# EasyEDA Pro project MRV_PCB_github_export.epro

# Schematic Adafruit TB6612
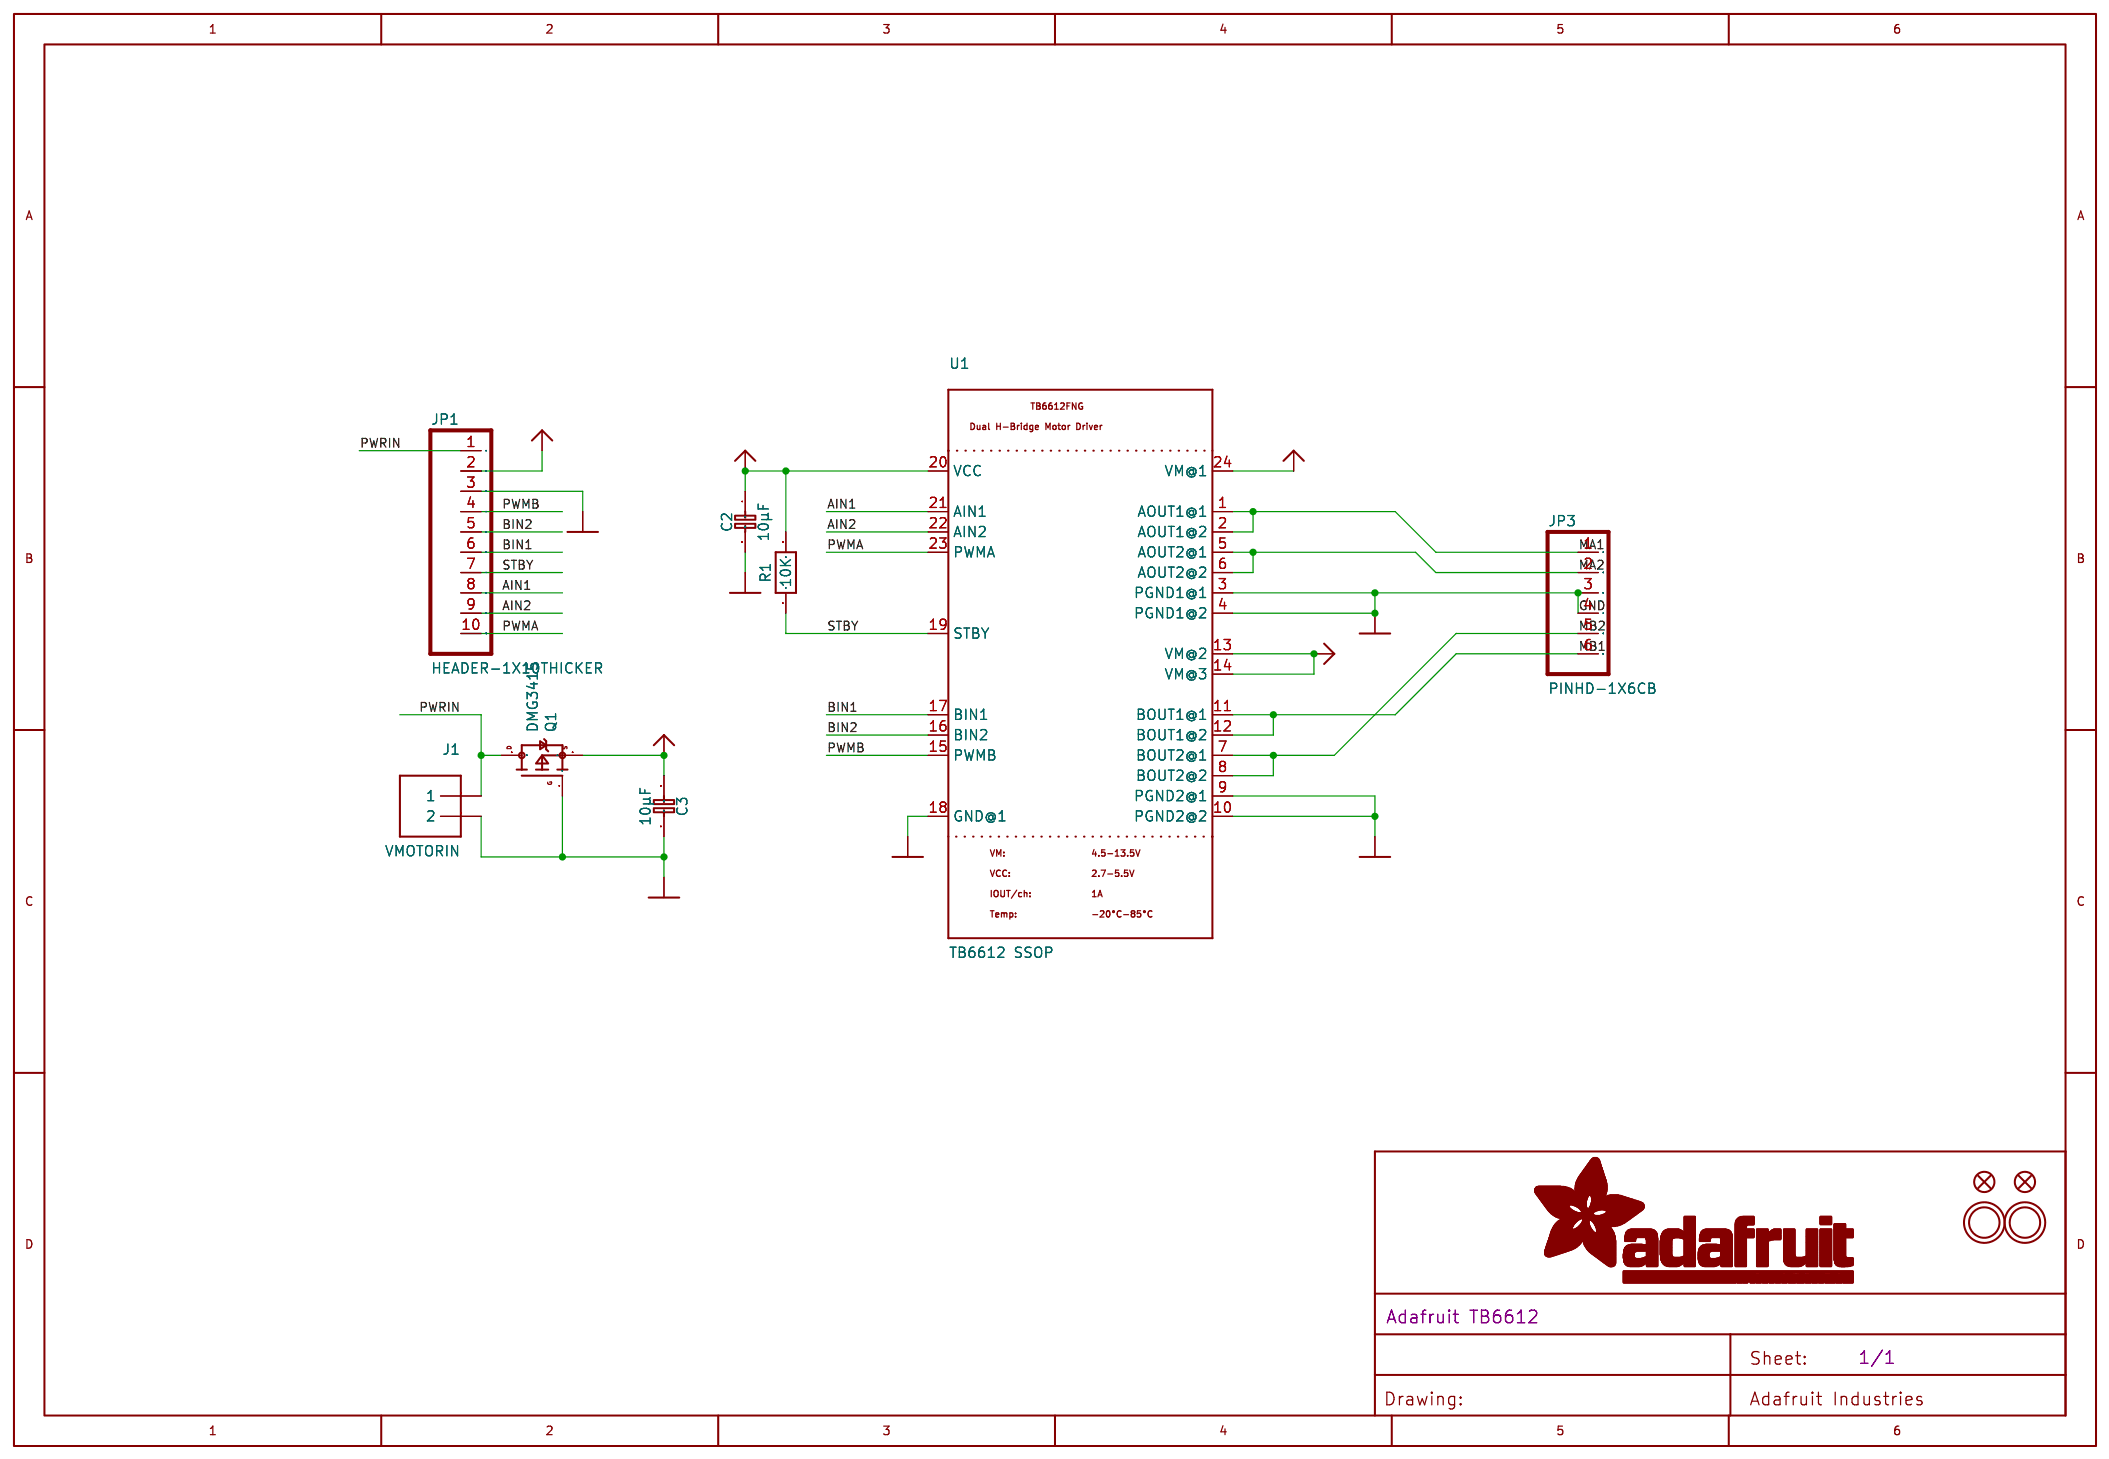
[diagram p0: schematic sheet]

## Parts
C2  10µF  [0805-NO]
C3  10µF  [0805-NO]
FID1  FIDUCIAL""  [FIDUCIAL_1MM]
FID2  FIDUCIAL""  [FIDUCIAL_1MM]
J1  VMOTORIN  [TERMBLOCK_1X2-3.5MM]
JP1  HEADER-1X10THICKER  [1X10_ROUND_76]
JP3  PINHD-1X6CB  [1X06-CLEANBIG]
Q1  DMG3415  [SOT23-WIDE]
R1  10K  [0805-NO]
U1  TB6612 SSOP  [SSOP24]
U$1  FRAME_A4_ADAFRUIT
U$13  MOUNTINGHOLE2.5  [MOUNTINGHOLE_2.5_PLATED]
U$14  MOUNTINGHOLE2.5  [MOUNTINGHOLE_2.5_PLATED]

## Library data of the parts
C2 C3 = microbuilder_CAP_CERAMIC_0805-NOOUTLINE
FID1 FID2 = microbuilder_FIDUCIAL_"": BOM: EXCLUDE
J1 = microbuilder_TERMBLOCK_1X2_
JP1 = microbuilder_HEADER-1X10_THICKER
JP3 = adafruit_PINHD-1X6_CB
Q1 = microbuilder_MOSFET-P_WIDE
R1 = microbuilder_RESISTOR_0805_NOOUTLINE
U1 = microbuilder_TB6612FNG_SSOP
U$1 = microbuilder_FRAME_A4_ADAFRUIT_: DRAWING_NAME: Adafruit TB6612; SHEET: 1/1
U$13 U$14 = microbuilder_MOUNTINGHOLE_2.5: BOM: EXCLUDE

## Nets
GND: C2.2 C3.2 J1.2 JP1.3 JP3.3 JP3.4 Q1.1(G) U1.3(PGND1@1) U1.4(PGND1@2) U1.9(PGND2@1) U1.10(PGND2@2) U1.18(GND@1)
VCC: C2.1 JP1.2 R1.2 U1.20(VCC)
AIN1: JP1.8 U1.21(AIN1)
AIN2: JP1.9 U1.22(AIN2)
BIN1: JP1.6 U1.17(BIN1)
BIN2: JP1.5 U1.16(BIN2)
MA1: JP3.1 U1.1(AOUT1@1) U1.2(AOUT1@2)
MA2: JP3.2 U1.5(AOUT2@1) U1.6(AOUT2@2)
MB1: JP3.6 U1.11(BOUT1@1) U1.12(BOUT1@2)
MB2: JP3.5 U1.7(BOUT2@1) U1.8(BOUT2@2)
PWMA: JP1.10 U1.23(PWMA)
PWMB: JP1.4 U1.15(PWMB)
PWRIN: J1.1 JP1.1 Q1.3(D)
STBY: JP1.7 R1.1 U1.19(STBY)
VMOTOR: C3.1 Q1.2(S) U1.13(VM@2) U1.14(VM@3) U1.24(VM@1)

# Schematic Battery
Create Date: 2026-02-02; Page Name: P1; Project Name: MRV; Schematic Name: Battery; Update Date: 2026-02-02; Company: EasyEDA.com; Page Size: A4; Version: V1.0
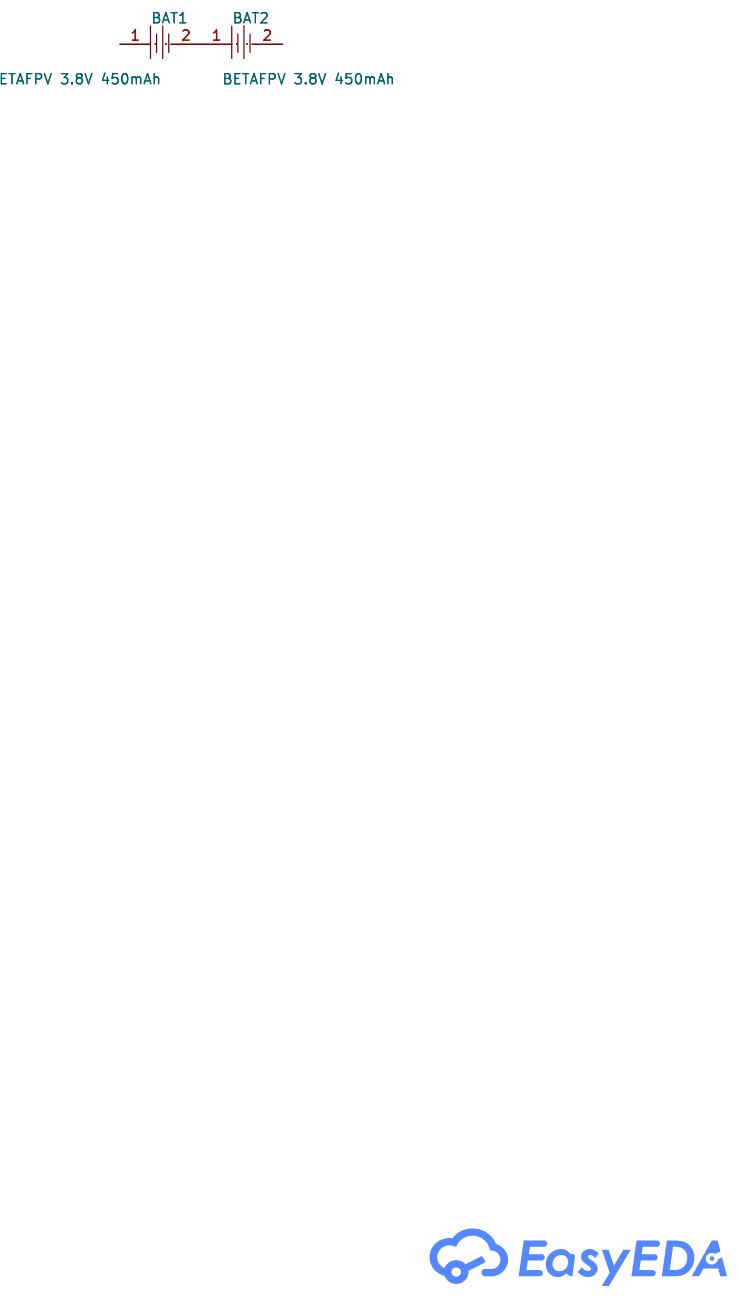
[diagram p1: schematic sheet]

## Parts
BAT1  BETAFPV 3.8V 450mAh  [BAT-TH_BD14.1-P5.30-D0.8_H49.55]
BAT2  BETAFPV 3.8V 450mAh  [BAT-TH_BD14.1-P5.30-D0.8_H49.55]

## Library data of the parts
BAT1 BAT2 = SVM1450 3.7V 500mAh: nominal voltage:3.7V capacity:560mAh Chemical system:Lithium Manganate size:14.07mm×49.55mm model No:- Type:Battery Type of electrolyte:- unit:1 Piece Battery Rechargeability:Rechargeable; LCSC Part Name: Sharvin Power(经钛电子) 锰酸锂电池 3.7V 560mAh 1个; Supplier Part: C42404727; Manufacturer: Sharvin Power(经钛电子); Datasheet: https://item.szlcsc.com/datasheet/SVM1450%25203.7V%2520500mAh/44369696.html; Supplier: LCSC; nominal voltage: 3.7V; capacity: 560mAh; Chemical system: Lithium Manganate; size: 14.07mm×49.55mm; Type: Battery; unit: 1 Piece; Battery Rechargeability: Rechargeable

## Nets
Net-(BAT1-2): BAT1.2 BAT2.1

Not connected (* = marked no-connect by the designer): BAT1 1; BAT2 2

# Schematic SCH_Servo-Motor-SG-90_2026-02-02
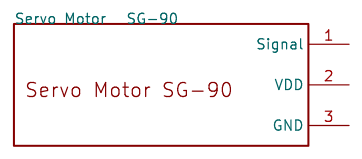
[diagram p2: schematic sheet]

## Parts
SG-90  Servo Motor

## Library data of the parts
SG-90 = Servo Motor

## Nets

Not connected (* = marked no-connect by the designer): SG-90 1(Signal) 2(VDD) 3(GND)

# Schematic Schematic1
Board Name: Board1; Create Date: 2026-02-04; Page Name: P1; Project Name: MRV; Schematic Name: Schematic1; Update Date: 2026-02-05; Company: EasyEDA.com; Page Size: A4; Version: V1.0
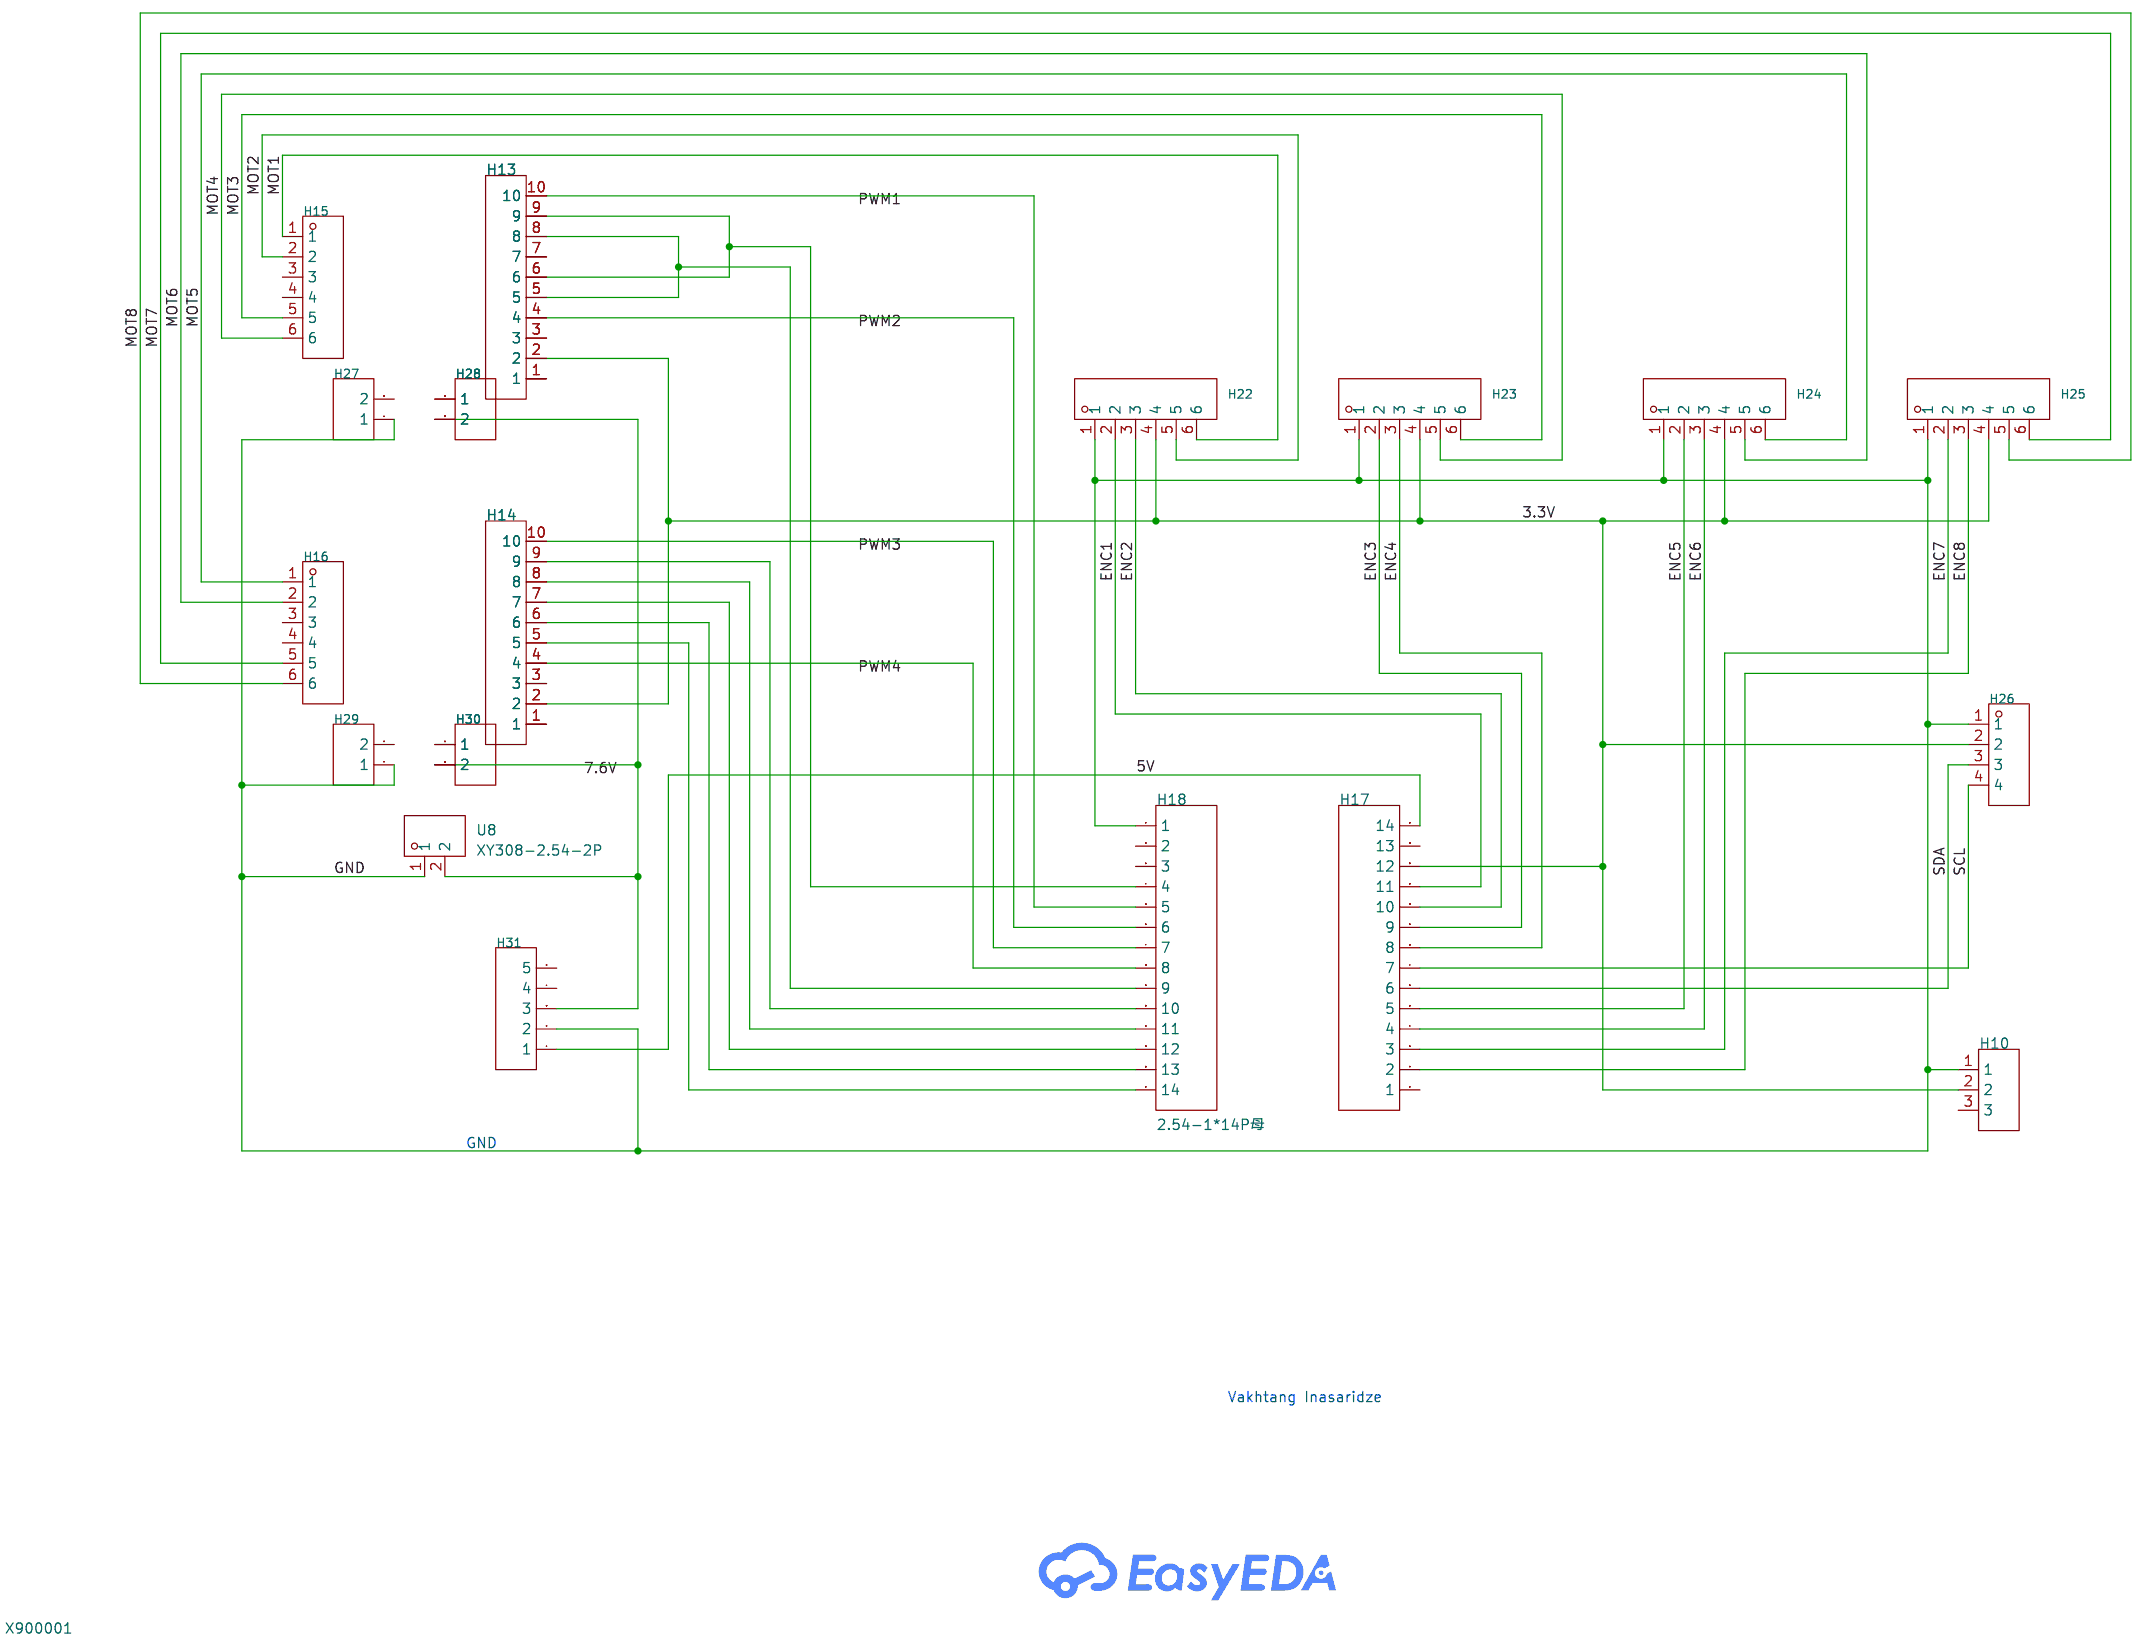
[diagram p3: schematic sheet]

## Parts
H10  -  [HDR-TH_3P-P2.54-V-M]
H13  -  [HDR-TH_10P-P2.54-V-F]
H14  -  [HDR-TH_10P-P2.54-V-F]
H15  -  [HDR-TH_6P-P2.54-V-F]
H16  -  [HDR-TH_6P-P2.54-V-F]
H17  2.54-1*14P母  [HDR-TH_14P-P2.54-V-F-1]
H18  2.54-1*14P母  [HDR-TH_14P-P2.54-V-F-1]
H22  -  [HDR-TH_6P-P2.54-V-F]
H23  -  [HDR-TH_6P-P2.54-V-F]
H24  -  [HDR-TH_6P-P2.54-V-F]
H25  -  [HDR-TH_6P-P2.54-V-F]
H26  -  [HDR-TH_4P-P2.54-V-F]
H27  -  [HDR-TH_2P-P2.54-V-F]
H28  -  [HDR-TH_2P-P2.54-V-F]
H29  -  [HDR-TH_2P-P2.54-V-F]
H30  -  [HDR-TH_2P-P2.54-V-F]
H31  -  [HDR-TH_5P-P2.54-V-F]
U8  XY308-2.54-2P  [CONN-TH_XY308-2.54-2P]

## Library data of the parts
H10 = HDR-M_2.54_1x3P: Supplier Footprint: Through
H13 H14 = HDR-F_2.54_1x10P: Supplier Footprint: Through
H15 H16 H22-H25 = HDR-F_2.54_1x6P: Supplier Footprint: Through
H17 H18 = 2.54-1*14P母: Holes Structure:1x14P Pitch:2.54mm Row Spacing:- Circular Hole / Square Hole:Square Hole Mounting Type:Through Hole Number of Rows:1 Number of Positions:14P Current Rating:3A Voltage Rating (Max):- Holes Direction:Top Insulation Height:- Contact Material:; LCSC Part Name: 1x14P 间距:2.54mm 直插; Supplier Part: C52711; Manufacturer: BOOMELE(博穆精密); Supplier Footprint: 插件,P=2.54mm; JLCPCB Part Class: Extended Part; Datasheet: https://item.szlcsc.com/datasheet/2.54-1*14P%25E6%25AF%258D/53725.html; Supplier: LCSC; Holes Structure: 1x14P; Pitch: 2.54mm; Circular Hole / Square Hole: Square Hole; Mounting Type: Through Hole; Number of Rows: 1; Number of Positions: 14P; Current Rating: 3A; Holes Direction: Top; Contact Material: Brass; Operating Temperature: -40℃~+105℃; PIN Length: 3.3mm
H26 = HDR-F_2.54_1x4P: Supplier Footprint: Through
H27-H30 = HDR-F_2.54_1x2P: Supplier Footprint: Through
H31 = HDR-F_2.54_1x5P: Supplier Footprint: Through
U8 = XY308-2.54-2P: Number of Positions or Pins:1x2P Pitch:2.54mm Color:Green Mounting Type:Through Hole Number of Pins:2P Number of Rows:1 Number of PINs Per Row:2 Screw Specification:M1.6 Current Rating:6A Voltage Rating (Max):150V Wire Gauge - AWG:18~26 Wire Gauge - mm2:1; LCSC Part Name: 1x2P 2.54mm 直插 排数:1 每排P数:2; Supplier Part: C557685; Manufacturer: XINLAIYA(新莱亚); Supplier Footprint: 插件,P=2.54mm; JLCPCB Part Class: Extended Part; Datasheet: https://item.szlcsc.com/datasheet/XY308-2.54-2P/581048.html; Supplier: LCSC; Number of Positions or Pins: 1x2P; Pitch: 2.54mm; Color: Green; Mounting Type: Through Hole; Number of Pins: 2P; Number of Rows: 1; Number of PINs Per Row: 2; Screw Specification: M1.6; Current Rating: 6A; Voltage Rating (Max): 150V; Wire Gauge - AWG: 18~26; Wire Gauge - mm2: 1

## Nets
3.3V: H10.2 H13.2 H14.2 H17.12 H22.4 H23.4 H24.4 H25.4 H26.2
5V: H17.14 H31.1
7.6V: H28.2 H30.2 H31.3 U8.2
GND: H10.1 H18.1 H22.1 H23.1 H24.1 H25.1 H26.1 H27.1 H29.1 H31.2 U8.1
ENC1: H17.11 H22.2
ENC2: H17.10 H22.3
ENC3: H17.9 H23.2
ENC4: H17.8 H23.3
ENC5: H17.5 H24.2
ENC6: H17.4 H24.3
ENC7: H17.3 H25.2
ENC8: H17.2 H25.3
MOT1: H15.1 H22.6
MOT2: H15.2 H22.5
MOT3: H15.5 H23.6
MOT4: H15.6 H23.5
MOT5: H16.1 H24.6
MOT6: H16.2 H24.5
MOT7: H16.5 H25.6
MOT8: H16.6 H25.5
PWM1: H13.10 H18.5
PWM2: H13.4 H18.6
PWM3: H14.10 H18.7
PWM4: H14.4 H18.8
SCL: H17.7 H26.4
SDA: H17.6 H26.3
$1N1454: H13.6 H13.9 H18.4
$1N1462: H13.5 H13.8 H18.9
Net-(H14-5): H14.5 H18.14
Net-(H14-6): H14.6 H18.13
Net-(H14-7): H14.7 H18.12
Net-(H14-8): H14.8 H18.11
Net-(H14-9): H14.9 H18.10

Not connected (* = marked no-connect by the designer): H10 3; H13 1 3 7; H14 1 3; H15 3 4; H16 3 4; H17 1 13; H18 2 3; H27 2; H28 1; H29 2; H30 1; H31 4 5

## Notes on the sheet
- GND
- Vakhtang Inasaridze

# Schematic SparkFun_Micro_6DoF_LSM6DSV16X
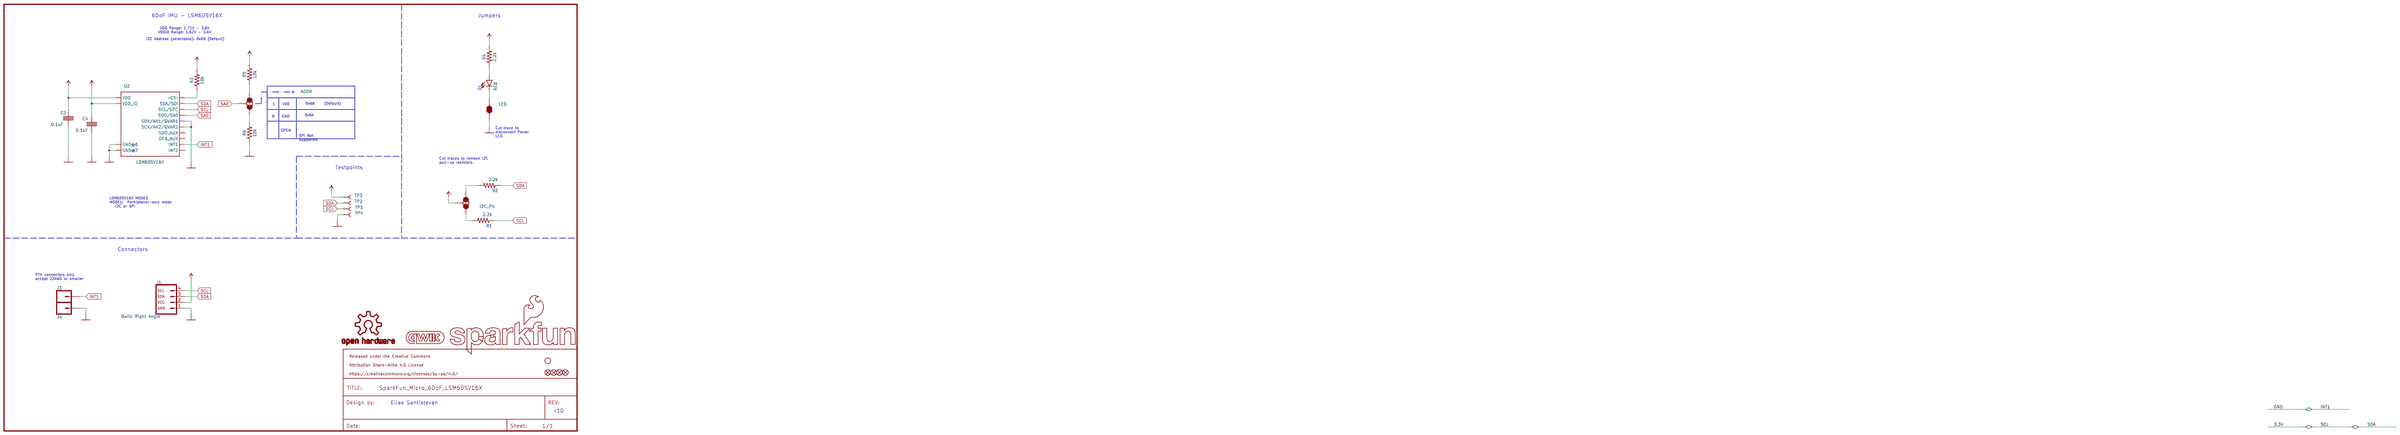
[diagram p4: schematic sheet]

## Parts
ADDR  JUMPER-SMT_3_1-NC_TRACE_SILK  [SMT-JUMPER_3_1-NC_TRACE_SILK]
C3  0.1uF  [0402-TIGHT]
C4  0.1uF  [0402-TIGHT]
D1  RED  [LED-0402]
FD1  FIDUCIALUFIDUCIAL  [FIDUCIAL-MICRO]
FD2  FIDUCIALUFIDUCIAL  [FIDUCIAL-MICRO]
FID1  FIDUCIALUFIDUCIAL  [FIDUCIAL-MICRO]
FID2  FIDUCIALUFIDUCIAL  [FIDUCIAL-MICRO]
FRAME1  FRAME-LETTER  [CREATIVE_COMMONS]  (sections G$1,V)
I2C_PU  S_MODE  [SMT-JUMPER_3_2-NC_TRACE_SILK]
J1  Qwiic Right Angle  [JST04_1MM_RA]
J3  CONN_01_1MM  [1X01_1MM_NO_SILK]
J4  CONN_01_1MM  [1X01_1MM_NO_SILK]
LED  JUMPER-SMT_2_NC_TRACE_SILK  [SMT-JUMPER_2_NC_TRACE_SILK]
LOGO1  QWIIC_LOGO_3MM  [QWIIC_3MM]
LOGO2  OSHW-LOGOMINI  [OSHW-LOGO-MINI]
LOGO3  SFE_LOGO_NAME_FLAMEBLANK  [BLANK]
R1  2.2k  [0402-TIGHT]
R2  2.2k  [0402-TIGHT]
R3  10k  [0402-TIGHT]
R4  2.2k  [0402-TIGHT]
R5  10k  [0402-TIGHT]
R6  10k  [0402-TIGHT]
STANDOFF1  STAND-OFFTIGHT  [STAND-OFF-TIGHT]
TP1  TEST-POINT3  [PAD.03X.03]
TP2  TEST-POINT3  [PAD.03X.03]
TP3  TEST-POINT3  [PAD.03X.03]
TP4  TEST-POINT3  [PAD.03X.03]
U2  LSM6DSV16X  [LGA-14L]

## Library data of the parts
ADDR = SparkFun-Jumpers_JUMPER-SMT_3_1-NC_TRACE__SILK
C3 C4 = SparkFun-Capacitors_0.1UF_-0402T-6.3V-10%-X7R
D1 = SparkFun-LED_LED-RED__0402: PROD_ID: DIO-16757
FD1 FD2 FID1 FID2 = SparkFun-Aesthetics_FIDUCIAL_UFIDUCIAL
FRAME1 = SparkFun-Aesthetics_FRAME-LETTER_: DESIGNER: Elias Santistevan; SHEET: 1/1; DRAWING_NAME: SparkFun_Micro_6DoF_LSM6DSV16X
I2C_PU = SparkFun-Jumpers_JUMPER-SMT_3_2-NC_TRACE__SILK
J1 = SparkFun-Connectors_I2C_STANDARD_QWIIC: PROD_ID: CONN-13694
J3 J4 = SparkFun-Connectors_CONN_01__1MM
LED = SparkFun-Jumpers_JUMPER-SMT_2_NC_TRACE__SILK
LOGO1 = SparkFun-Aesthetics_QWIIC_LOGO__3MM
LOGO2 = SparkFun-Aesthetics_OSHW-LOGO_MINI
LOGO3 = SparkFun-Aesthetics_SFE_LOGO_NAME_FLAME_BLANK
R1 R2 R4 = SparkFun-Resistors_2.2KOHM_-0402T-1/16W-1%
R3 R5 R6 = SparkFun-Resistors_10KOHM_-0402T-1/16W-1%: PROD_ID: CAP-14993
STANDOFF1 = SparkFun-Hardware_STAND-OFF_TIGHT
TP1-TP4 = SparkFun-Connectors_TEST-POINT_3
U2 = lsm6dsv16x_LSM6DSV16X_: PROD_ID: IC-17274

## Nets
3.3V: C3.1 C4.1 I2C_PU.2 J1.2 J1.3 J1.4 R1.1 R2.1 R3.2 R4.2 R5.2 TP1.1 TP2.1 TP3.1 U2.P5(VDD_IO) U2.P8(VDD) U2.P13(SCL/SPC) U2.P14(SDA/SDI)
GND: C3.2 C4.2 J1.1 J3.1 J4.1 LED.1 R6.1 TP4.1 U2.P2(SDX/AH1/QVAR1) U2.P3(SCX/AH2/QVAR2) U2.P4(INT1) U2.P6(GND@6) U2.P7(GND@7)
N$1: ADDR.3 R5.1
N$2: D1.A R4.1
N$3: D1.C LED.2
N$4: R3.1 U2.P12(~CS~)
N$5: I2C_PU.1 R1.2
N$6: I2C_PU.3 R2.2
N$7: ADDR.1 R6.2
SA0: ADDR.2 U2.P1(SDO/SA0)

Not connected (* = marked no-connect by the designer): U2 P9(INT2) P10(OCS_AUX) P11(SDO_AUX)

## Notes on the sheet
- 6DoF IMU - LSM6DSV16X
- Jumpers
- VDD Range: 1.71V - 3.6V
  VDDIO Range: 1.62V - 3.6V
- I2C Address (selectable): 0x6B (Default)
- 1
- VDD
- 0x6B
- (Default)
- 0x6A
- 0
- GND
- Cut trace to
  disconnect Power
  LED.
- OPEN
- SPI Not
  Supported
- Cut traces to remove I2C
  pull-up resistors.
- Testpoints
- LSM6DSV16X MODES
  MODE1:  Perhipheral-only mode
     I2C or SPI
- Connectors
- PTH connectors only
  accept 22AWG or smaller
- Elias Santistevan
- v10

# Board SparkFun_Micro_6DoF_LSM6DSV16X
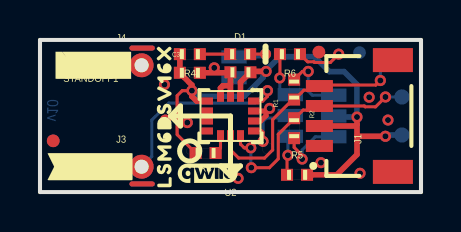
[diagram p5: board, top side]
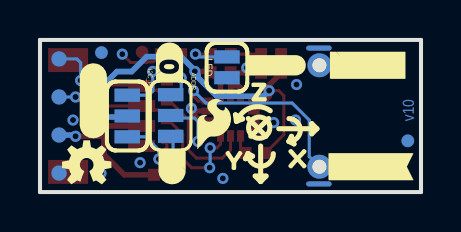
[diagram p6: board, bottom side, seen from below]

Outline 19.05 x 7.62 mm; copper layers: Top Layer, Bottom Layer. Coordinates in mm from the lower left corner of the outline.
Outline path: 0,7.62 0,0 19.05,0 19.05,7.62 0,7.62

## Design rules (mm)
via viaSize: diameter min 0.3, default 0.3, max 2.6; hole min 0.3, default 0.3, max 2
via default (default): diameter min 0, default 0, max 2.6; hole min 0, default 0, max 2
net GND uses CopperRegion1, default
net SCL uses default
net SDA uses default
net SA0 uses default
net INT1 uses default
net 3.3V uses default
net N$5 uses default
net N$6 uses default
net N$2 uses default
net N$3 uses default
net N$1 uses default
net N$7 uses default
net N$4 uses default
pour ie1 uses CopperRegion
pour ie2 uses CopperRegion1

## Placement (name value [footprint] x y rotation side)
ADDR  JUMPER-SMT_3_1-NC_TRACE_SILK  [SMT-JUMPER_3_1-NC_TRACE_SILK]  12.52 3.84 270 bottom
C3  0.1uF  [0402-TIGHT]  7.49 5.98 0 top
C4  0.1uF  [0402-TIGHT]  10.02 6 180 top
D1  RED  [LED-0402]  10.01 6.91 0 top
FD1  FIDUCIALUFIDUCIAL  [FIDUCIAL-MICRO]  15.98 6.98 180 bottom
FD2  FIDUCIALUFIDUCIAL  [FIDUCIAL-MICRO]  0.66 2.57 180 bottom
FID1  FIDUCIALUFIDUCIAL  [FIDUCIAL-MICRO]  13.94 7.01 0 top
FID2  FIDUCIALUFIDUCIAL  [FIDUCIAL-MICRO]  0.66 2.57 0 top
FRAME1  FRAME-LETTER  [CREATIVE_COMMONS]  -21.59 -22.86 0 top
I2C_PU  S_MODE  [SMT-JUMPER_3_2-NC_TRACE_SILK]  14.69 3.81 270 bottom
J1  Qwiic Right Angle  [JST04_1MM_RA]  13.97 3.81 90 top
J3  CONN_01_1MM  [1X01_1MM_NO_SILK]  5.08 1.27 0 top
J4  CONN_01_1MM  [1X01_1MM_NO_SILK]  5.08 6.35 0 top
LED  JUMPER-SMT_2_NC_TRACE_SILK  [SMT-JUMPER_2_NC_TRACE_SILK]  9.7 6.25 90 bottom
LOGO1  QWIIC_LOGO_3MM  [QWIIC_3MM]  8.38 0.94 0 top
LOGO2  OSHW-LOGOMINI  [OSHW-LOGO-MINI]  16.71 1.38 180 bottom
LOGO3  SFE_LOGO_NAME_FLAMEBLANK  [BLANK]  -39.37 -15.24 0 top
R1  2.2k  [0402-TIGHT]  12.71 5.13 90 top
R2  2.2k  [0402-TIGHT]  12.71 3.2 270 top
R3  10k  [0402-TIGHT]  8.28 1.96 180 top
R4  2.2k  [0402-TIGHT]  7.49 6.91 180 top
R5  10k  [0402-TIGHT]  12.85 0.86 0 top
R6  10k  [0402-TIGHT]  12.5 6.91 180 top
STANDOFF1  STAND-OFFTIGHT  [STAND-OFF-TIGHT]  2.54 3.81 0 top
TP1  TEST-POINT3  [PAD.03X.03]  18.1 6.67 270 bottom
TP2  TEST-POINT3  [PAD.03X.03]  18.1 4.76 180 bottom
TP3  TEST-POINT3  [PAD.03X.03]  18.1 2.86 180 bottom
TP4  TEST-POINT3  [PAD.03X.03]  18.1 0.95 180 bottom
U2  LSM6DSV16X  [LGA-14L]  9.53 3.81 180 top
U$1  -  [#0#4]  12.57 6.35 90 bottom
U$2  -  [#1#4]  12.45 1.4 90 bottom
U$3  -  [#LED#2121]  7.34 6.35 180 bottom
U$4  -  [#GND#4]  2.67 6.35 0 top
U$5  -  [#INT1#0]  2.67 1.27 0 top
U$6  -  [LSM6DSV16X31]  6.22 3.81 90 top
U$7  -  [X2114]  6.1 1.65 180 bottom
U$8  -  [Y2115]  9.27 1.58 180 bottom
U$9  -  [Z2116]  8.03 5 180 bottom
U$10  -  [#GND#4]  2.67 6.35 180 bottom
U$11  -  [#INT1#2]  2.67 1.27 180 bottom
U$12  -  [#I2C#4]  16.38 4.57 90 bottom
U$29  -  [SFE_LOGO_FLAME_.1]  10.36 3.43 180 bottom

## Footprints (pads in the part's own frame, mm; a bottom-side part is the same pattern mirrored in y, then rotated)
1X01_1MM_NO_SILK
  round 1.2 hole 0.7: 1(0,0)
0402-TIGHT
  rect 0.6x0.6 smd: 1(-0.5,0) 2(0.5,0)
FIDUCIAL-MICRO
  round 0.635 smd: 1(0,0)
JST04_1MM_RA
  rect 0.6x1.35 smd: 1(-1.5,0) 2(-0.5,0) 3(0.5,0) 4(1.5,0)
  rect 1.2x2 smd: NC1(2.8,-3.675) NC2(-2.8,-3.675)
LED-0402
  rect 0.6x0.6 smd: A(-0.5,0) C(0.5,0)
LGA-14L
  rect 0.575x0.35 smd: P1(-1.163,0.75) P2(-1.163,0.25) P3(-1.163,-0.25) P4(-1.163,-0.75) P8(1.163,-0.75) P9(1.163,-0.25) P10(1.163,0.25) P11(1.163,0.75)
  rect 0.35x0.575 smd: P5(-0.5,-1) P6(0,-1) P7(0.5,-1) P12(0.5,1) P13(0,1) P14(-0.5,1)
PAD.03X.03
  round 0.762 smd: 1(0,0)
SMT-JUMPER_2_NC_TRACE_SILK
  rect 0.66x1.27 smd: 1(-0.52,0) 2(0.52,0)
SMT-JUMPER_3_1-NC_TRACE_SILK
  rect 0.66x1.27 smd: 1(-1.042,0) 2(0,0) 3(1.042,0)
SMT-JUMPER_3_2-NC_TRACE_SILK
  rect 0.66x1.27 smd: 1(-1.042,0) 2(0,0) 3(1.042,0)

## Nets
3.3V: C3.1 C4.1 I2C_PU.2 J1.2 R3.2 R4.2 R5.2 TP3.1 U2.P5 U2.P8
GND: C3.2 C4.2 J1.1 J4.1 LED.1 R6.1 TP4.1 U2.P2 U2.P3 U2.P6 U2.P7
INT1: J3.1 U2.P4
N$1: ADDR.3 R5.1
N$2: D1.A R4.1
N$3: D1.C LED.2
N$4: R3.1 U2.P12
N$5: I2C_PU.1 R1.2
N$6: I2C_PU.3 R2.2
N$7: ADDR.1 R6.2
SA0: ADDR.2 U2.P1
SCL: J1.4 R1.1 TP1.1 U2.P13
SDA: J1.3 R2.1 TP2.1 U2.P14

Pads without a net: FD1 1; FD2 1; FID1 1; FID2 1; J1 NC1 NC2; U2 P9 P10 P11

## Via types
v1: diameter 0.554, hole 0.3, Top Layer to Bottom Layer, 23 vias
v2: diameter 0.559, hole 0.305, Top Layer to Bottom Layer, 3 vias

## Routing (per net, layer and track width the routed paths; a pad name or vN(x,y) marks a point on that pad's centre or on a via; arc(x,y) is an arc through that point)
3.3V: length 31.2
  Top Layer w0.152: R3.2 6.86,2.88 6.86,4.83 7.11,5.08 v1(7.59,5.08)
  Top Layer w0.28: 15.85,2.79 v2(17.27,2.79) ; 15.85,2.79 15.85,1.88 14.83,0.86 R5.2 ; 15.85,2.79 15.85,3.38 ; 15.85,3.38 15.78,3.31 J1.2 ; 15.85,3.38 v1(15.85,3.76) ; U2.P5 10.03,5.51 C4.1 10.56,6.05 v1(11.31,6.05) ; U2.P8 7.83,4.56 7.59,4.79 v1(7.59,5.08) 7.59,5.36 6.99,5.96 C3.1 R4.2
  Bottom Layer w0.28: v1(7.59,5.08) 7.87,4.8 10.21,4.8 11.16,5.75 11.16,5.89 v1(11.31,6.05) 11.31,6.1 11.99,6.78 13.72,6.78 14.46,6.03 15.2,6.03 15.84,5.39 15.84,3.77 v1(15.85,3.76) 14.74,3.76 I2C_PU.2 ; TP3.1 17.34,2.86 v2(17.27,2.79)
GND: length 11.9
  Top Layer w0.152: v1(14.94,6.91) 14.52,6.49 13.73,6.49 13.69,6.53 13.38,6.53 R6.1
  Top Layer w0.254: U2.P3 11.3,4.06 ; 11.3,4.06 11.3,3.83 11.03,3.56 U2.P2 ; 11.3,4.06 11.43,4.19 v1(11.48,4.19) ; 5.61,0.41 4.6,0.41 ; 5.61,7.21 4.6,7.21
  Top Layer w0.28: U2.P7 9.03,5.21 9.14,5.32 9.43,5.32 9.52,5.41 ; U2.P6 9.52,4.81 9.52,5.41 ; 9.52,5.41 C4.2 9.47,5.95 9.45,5.98 C3.2
  Bottom Layer w0.254: 4.6,0.41 5.61,0.41 ; 4.6,7.21 5.61,7.21
  vias: v1(6.22,5.39) v1(6.27,3.61) v1(7.37,3.48) v1(8.71,6.22) v1(9.91,0.69) v1(14.05,1.47) v1(16,0.94) v1(16.46,4.75) v1(17.4,3.61)
INT1: length 10
  Top Layer w0.152: v1(11.38,5.08) 11.38,4.8 11.14,4.56 U2.P4
  Bottom Layer w0.152: J3.1 5.59,1.78 5.59,3.61 6.44,4.46 10.75,4.46 v1(11.38,5.08)
N$1: length 2
  Top Layer w0.152: v1(12.4,1.84) 12.35,1.8 R5.1
  Bottom Layer w0.152: ADDR.3 12.4,2.67 v1(12.4,1.84)
N$2: length 1.5
  Top Layer w0.152: D1.A R4.1
N$3: length 2.4
  Top Layer w0.152: D1.C v1(11.28,6.91)
  Bottom Layer w0.152: v1(11.28,6.91) 11.14,6.77 LED.2
N$4: length 1
  Top Layer w0.152: U2.P12 9.03,2.2 R3.1
N$5: length 3.2
  Top Layer w0.152: v1(13.41,6.05) 13.12,6.05 R1.2
  Bottom Layer w0.152: v1(13.41,6.05) 13.41,5.05 13.61,4.85 I2C_PU.1
N$6: length 3.5
  Top Layer w0.152: v1(13.11,1.65) 13.11,1.84 12.71,2.24 R2.2
  Bottom Layer w0.152: v1(13.11,1.65) 13.11,2.11 13.77,2.77 I2C_PU.3
N$7: length 2.5
  Top Layer w0.152: v1(11.99,5.72) 12,5.72 R6.2
  Bottom Layer w0.152: v1(11.99,5.72) 11.99,5.02 12.13,4.88 ADDR.1
SA0: length 3.4
  Top Layer w0.152: U2.P1 11.09,3.06 11.15,3 v1(11.15,2.54)
  Bottom Layer w0.152: v1(11.15,2.54) 11.15,3.53 11.33,3.71 12.39,3.71 ADDR.2
SCL: length 12.9
  Top Layer w0.152: U2.P13 9.53,2.11 9.93,1.7 11.23,1.7 11.63,2.11 11.63,3.63 12.63,4.63 R1.1 12.72,4.63 13.2,5.11 13.77,5.11 J1.4 14.02,5.36 16.79,5.36 v2(17.02,5.59)
  Bottom Layer w0.152: TP1.1 17.21,6.67 17.02,6.48 v2(17.02,5.59)
SDA: length 11.8
  Top Layer w0.152: U2.P14 10.03,2.4 10.21,2.21 v1(10.54,2.21) ; v2(17.27,4.76) 16.78,4.27 16.26,4.27 16.22,4.31 J1.3 13.77,4.11 13.16,4.11 12.75,3.7 R2.1 12.71,3.69 11.91,2.9 11.91,1.66 11.47,1.22 10.57,1.22 v1(10.57,1.22)
  Bottom Layer w0.152: v1(10.54,2.21) 10.54,1.25 v1(10.57,1.22) ; v2(17.27,4.76) TP2.1

## Copper pours and planes (outline as drawn; the poured copper is in the pictures)
GND on Top Layer: 19.05,0 19.05,7.62 0,7.62 0,0
GND on Bottom Layer: 19.05,0 19.05,7.62 0,7.62 0,0

## Text on the board
Bottom Layer: v10
Reference: Units in Inches

# Board Adafruit TB6612
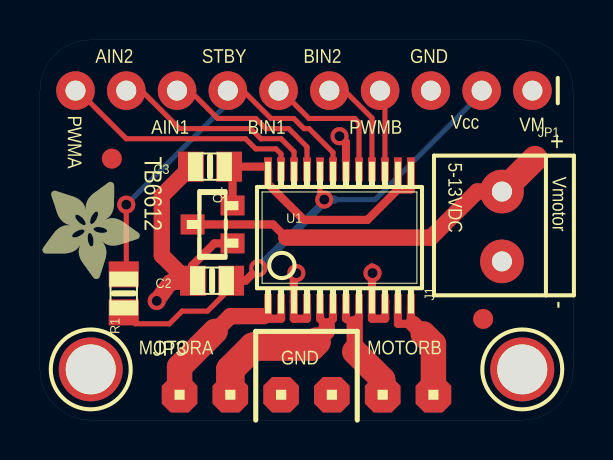
[diagram p7: board, top side]
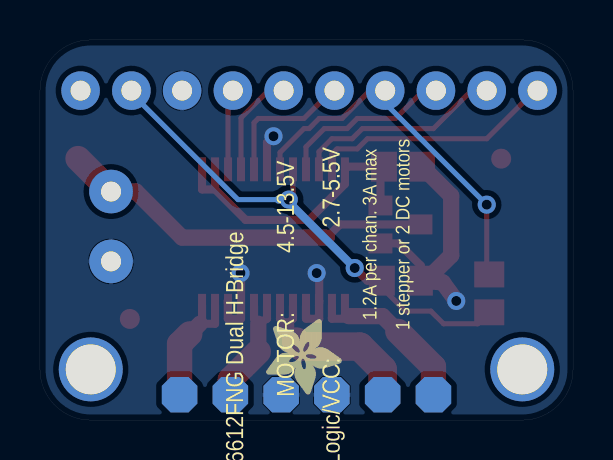
[diagram p8: board, bottom side, seen from below]

Outline 26.67 x 19.05 mm; copper layers: Top Layer, Bottom Layer. Coordinates in mm from the lower left corner of the outline.
Outline path: 0,16.51 arc(0.74,18.31) 2.54,19.05 24.13,19.05 arc(25.93,18.31) 26.67,16.51 26.67,2.54 arc(25.93,0.74) 24.13,0 2.54,0 arc(0.74,0.74) 0,2.54 0,16.51
Stack: Top Layer 0.035mm / Dielectric1 1.51mm FR4 er 4.5 / Bottom Layer 0.035mm

## Design rules (mm)
spacing safeClearance (default): track to track 0.203, other pairs 0 to 0.254
track width trackWidth: min 0.203, default 0.203, max 2.54
track width default (default): min 0.003, default 0.003, max 2.54
differential pair differentialPair (default): width min 0.127, default 0.254, max 2.54; gap min 0.152, default 0.152
via viaSize: diameter min 0.394, default 0.394, max 2.6; hole min 0.394, default 0.394, max 2
via default (default): diameter min 0, default 0, max 2.6; hole min 0, default 0, max 2
pour ie141 uses CopperRegion

## Placement (name value [footprint] x y rotation side)
C2  10µF  [0805-NO]  8.61 6.98 180 top
C3  10µF  [0805-NO]  8.51 12.7 180 top
FID1  FIDUCIAL""  [FIDUCIAL_1MM]  3.59 13.1 270 top
FID2  FIDUCIAL""  [FIDUCIAL_1MM]  22.17 5.07 270 top
J1  VMOTORIN  [TERMBLOCK_1X2-3.5MM]  23.11 9.65 90 top
JP1  HEADER-1X10THICKER  [1X10_ROUND_76]  13.21 16.51 180 top
JP3  PINHD-1X6CB  [1X06-CLEANBIG]  13.34 1.27 0 top
Q1  DMG3415  [SOT23-WIDE]  8.64 9.8 90 top
R1  10K  [0805-NO]  4.19 6.35 270 top
U1  TB6612 SSOP  [SSOP24]  14.99 9.14 0 top
U$11  -  [ADAFRUIT_3.5MM]  15.37 5.08 270 bottom
U$13  MOUNTINGHOLE2.5  [MOUNTINGHOLE_2.5_PLATED]  24.13 2.54 270 top
U$14  MOUNTINGHOLE2.5  [MOUNTINGHOLE_2.5_PLATED]  2.54 2.54 270 top
U$15  -  [ADAFRUIT_5MM]  0.13 11.94 270 top

## Footprints (pads in the part's own frame, mm; a bottom-side part is the same pattern mirrored in y, then rotated)
1X06-CLEANBIG
  custom 1.778x1.778 hole 1.016: 1(-6.35,0) 2(-3.81,0) 3(-1.27,0) 4(1.27,0) 5(3.81,0) 6(6.35,0)
1X10_ROUND_76
  round 1.931 hole 1: 1(-11.43,0) 2(-8.89,0) 3(-6.35,0) 4(-3.81,0) 5(-1.27,0) 6(1.27,0) 7(3.81,0) 8(6.35,0) 9(8.89,0) 10(11.43,0)
0805-NO
  rect 1.3x1.5 smd: 1(-0.95,0) 2(0.95,0)
FIDUCIAL_1MM
  round 1 smd: 1(0,0)
MOUNTINGHOLE_2.5_PLATED
  round 3.2 hole 2.5: P$1(0,0)
SOT23-WIDE
  rect 1x1.2 smd: 1(-0.95,-1) 2(0.95,-1) 3(0,1)
SSOP24
  rect 0.4x1.2 smd: 1(-3.575,-3.42) 2(-2.925,-3.42) 3(-2.275,-3.42) 4(-1.625,-3.42) 5(-0.975,-3.42) 6(-0.325,-3.42) 7(0.325,-3.42) 8(0.975,-3.42) 9(1.625,-3.42) 10(2.275,-3.42) 11(2.925,-3.42) 12(3.575,-3.42) 13(3.575,3.42) 14(2.925,3.42) 15(2.275,3.42) 16(1.625,3.42) 17(0.975,3.42) 18(0.325,3.42) 19(-0.325,3.42) 20(-0.975,3.42) 21(-1.625,3.42) 22(-2.275,3.42) 23(-2.925,3.42) 24(-3.575,3.42)
TERMBLOCK_1X2-3.5MM
  round 2.184 hole 1: 1(1.8,0) 2(-1.7,0)

## Nets
As in the schematic.

Pads without a net: FID1 1; FID2 1; U$13 P$1; U$14 P$1

## Via types
v1: diameter 0.906, hole 0.5, Top Layer to Bottom Layer, 7 vias

## Routing (per net, layer and track width the routed paths; a pad name or vN(x,y) marks a point on that pad's centre or on a via; arc(x,y) is an arc through that point)
GND: length 23.2
  Top Layer w0.254: 7.37,6.98 C2.2
  Top Layer w0.406: v1(16.64,7.37) 16.61,7.65 U1.9 16.61,5.08 17.27,5.08 17.27,5.98 U1.10 ; v1(14.99,14.22) 15.31,13.91 U1.18 ; 12.7,5.98 12.7,5.08 13.36,5.08 U1.4 ; 12.7,5.98 U1.3 ; 12.7,5.98 12.7,7.24 v1(12.83,7.37) ; Q1.1 8.73,8.85 7.62,7.75 7.62,7.03
  Top Layer w0.813: 7.37,6.98 6.1,8.25 6.1,11.24 C3.2 ; v1(5.84,5.97) 6.52,6.9 C2.2
  Bottom Layer w0.406: v1(5.84,5.97) 5.97,5.97 ; v1(14.99,14.22) 14.99,14.1
VCC: length 25
  Top Layer w0.254: U1.20 14.01,11.26 v1(14.22,11.05) ; C2.1 9.56,6.64 8.38,5.46 7.11,5.46 6.48,4.83 4.77,4.83 R1.2
  Top Layer w0.406: v1(10.92,7.62) 10.29,6.98 C2.1
  Bottom Layer w0.254: 14.73,11.05 16.76,11.05 22.23,16.51 ; 14.35,11.05 v1(14.22,11.05)
  Bottom Layer w0.406: 14.73,11.05 14.35,11.05 v1(10.92,7.62)
AIN1: length 8.7
  Top Layer w0.254: 6.99,16.51 7.49,16.51 8.89,15.11 10.8,15.11 11.3,14.6 12.45,14.6 13.36,13.69 U1.21
AIN2: length 10.4
  Top Layer w0.254: U1.22 12.71,13.45 12.06,14.1 11.05,14.1 10.54,14.6 6.99,14.6 5.08,16.51 4.45,16.51
BIN1: length 6.9
  Top Layer w0.254: 12.06,16.51 13.46,15.11 15.75,15.11 15.96,14.9 U1.17
BIN2: length 5.1
  Top Layer w0.254: U1.16 16.61,15.14 15.24,16.51 14.61,16.51
MA1: length 8.6
  Top Layer w0.254: U1.1 11.41,5.08
  Top Layer w0.406: 11.41,5.08 12.06,5.08 U1.2
  Top Layer w0.813: 11.22,5.21 9.53,5.21 8.76,4.44
  Top Layer w1.27: JP3.1 6.99,2.67 8.76,4.44
MA2: length 9.4
  Top Layer w0.406: U1.6 14.66,5.08 14.35,4.7 14.01,5.08 U1.5
  Top Layer w0.813: 14.35,4.7 14.35,4.44 13.84,3.94
  Top Layer w1.423: 13.84,3.94 13.59,3.68 10.67,3.68 9.53,2.54 JP3.2
MB1: length 6.6
  Top Layer w0.406: U1.12 18.56,5.08 18.67,4.83 17.91,4.83 U1.11
  Top Layer w0.813: 18.67,4.83 19.18,4.32
  Top Layer w1.27: 19.18,4.32 19.69,3.81 JP3.6
MB2: length 6.3
  Top Layer w0.406: U1.7 15.31,5.08 15.75,4.83 15.96,5.08 U1.8
  Top Layer w0.813: 15.75,3.43 15.75,4.83
  Top Layer w1.27: 15.75,3.43 17.15,2.03 JP3.5
PWMA: length 12.2
  Top Layer w0.254: U1.23 12.06,13.34 11.81,13.59 10.8,13.59 10.29,14.1 4.32,14.1 1.91,16.51
PWMB: length 4
  Top Layer w0.254: U1.15 17.26,16.39 17.15,16.51
PWRIN: length 19
  Top Layer w0.406: Q1.3 11.66,9.8 12.32,9.14
  Top Layer w0.813: J1.1 21.87,11.45 19.56,9.14 12.32,9.14
  Top Layer w1.27: 24.77,13.1 J1.1
STBY: length 18.7
  Top Layer w0.254: v1(4.32,10.79) 4.32,7.43 R1.1 ; U1.19 14.66,13.41 13.46,14.6 13.21,14.6 12.7,15.11 11.56,15.11 10.16,16.51 9.53,16.51
  Bottom Layer w0.254: v1(4.32,10.79) 9.53,16 9.53,16.51
VMOTOR: length 15.3
  Top Layer w0.406: U1.14 17.91,11.56 ; 17.91,11.56 16.38,10.03 13.21,10.03 11.41,11.83 U1.24 11.28,12.7 C3.1 9.64,12.52 Q1.2 ; 17.91,11.56 18.56,11.56 U1.13

## Copper pours and planes (outline as drawn; the poured copper is in the pictures)
GND on Bottom Layer: 0,19.05 26.73,19.05 26.73,-0.06 0,0.19

## Text on the board
Bottom Silkscreen Layer: 1 stepper or 2 DC motors | 1.2A per chan. 3A max | 2.7-5.5V | Logic/VCC: | 4.5-13.5V | MOTOR: | TB6612FNG Dual H-Bridge
Top Silkscreen Layer: PWMA | 5-13VDC | Vmotor | AIN2 | MOTORA | AIN1 | STBY | BIN1 | GND | BIN2 | PWMB | MOTORB | Vcc | VM | TB6612 | - | +

# Board PCB10
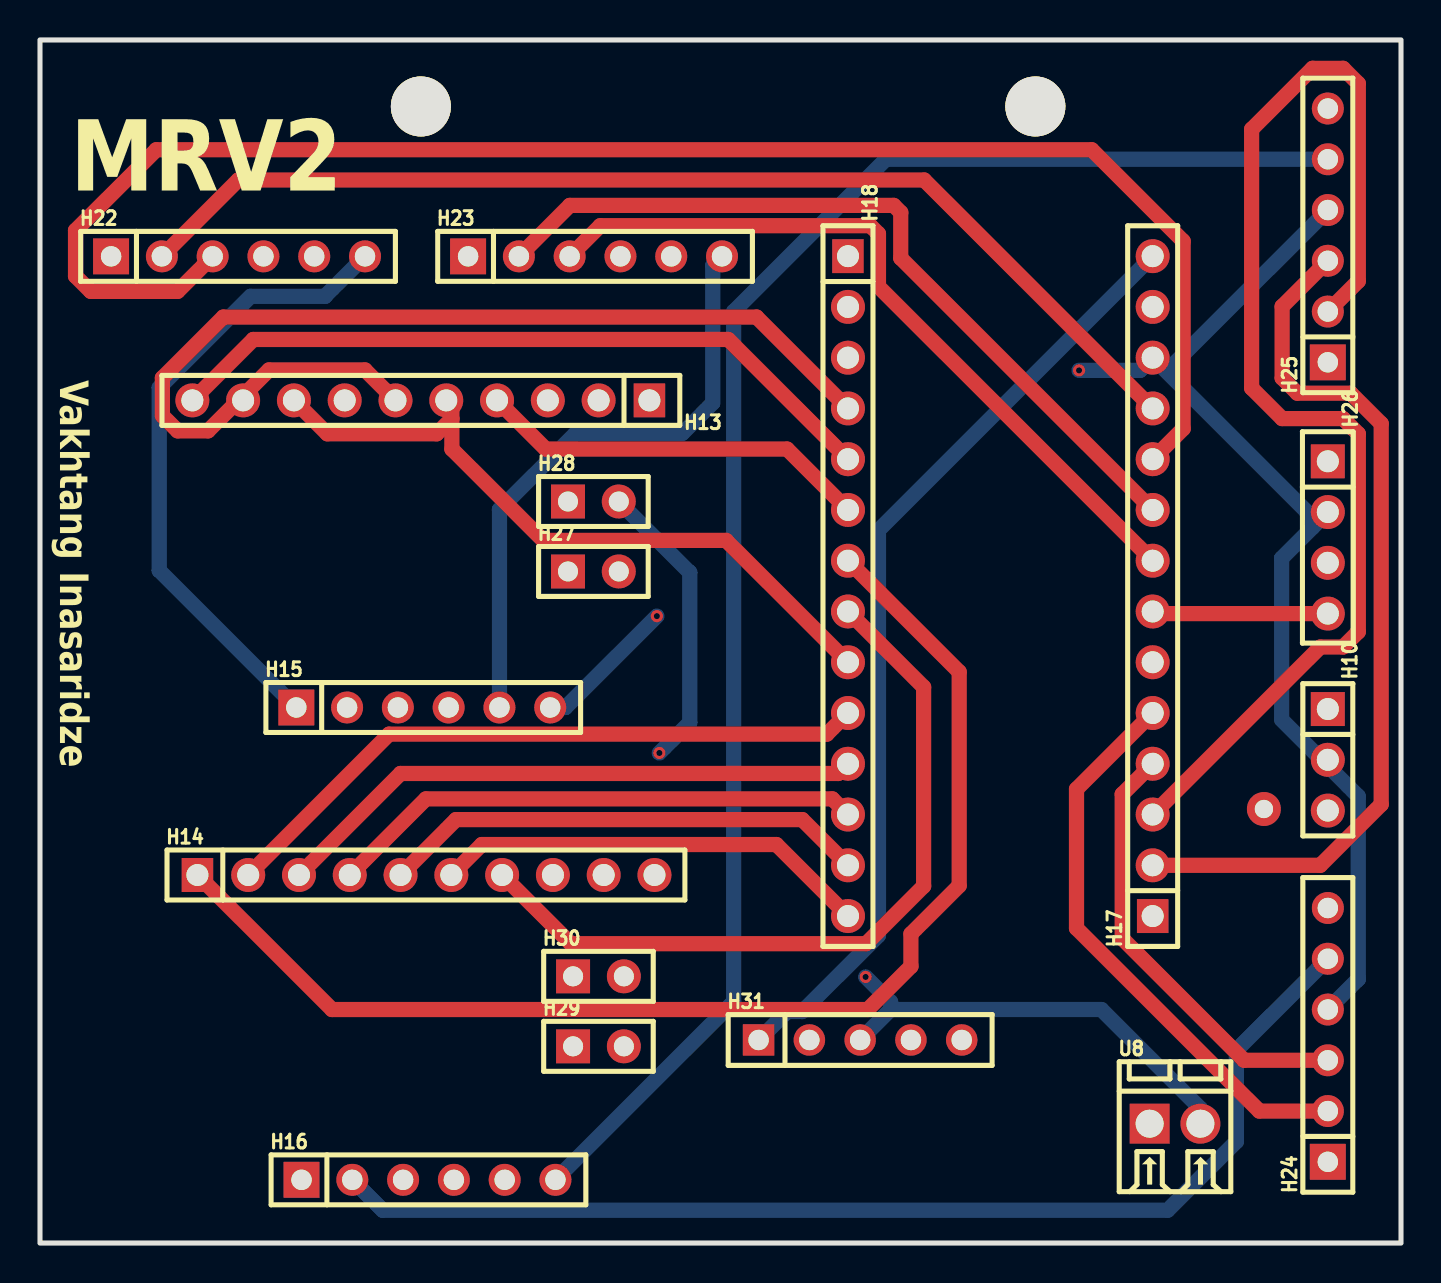
[diagram p9: board, top side]
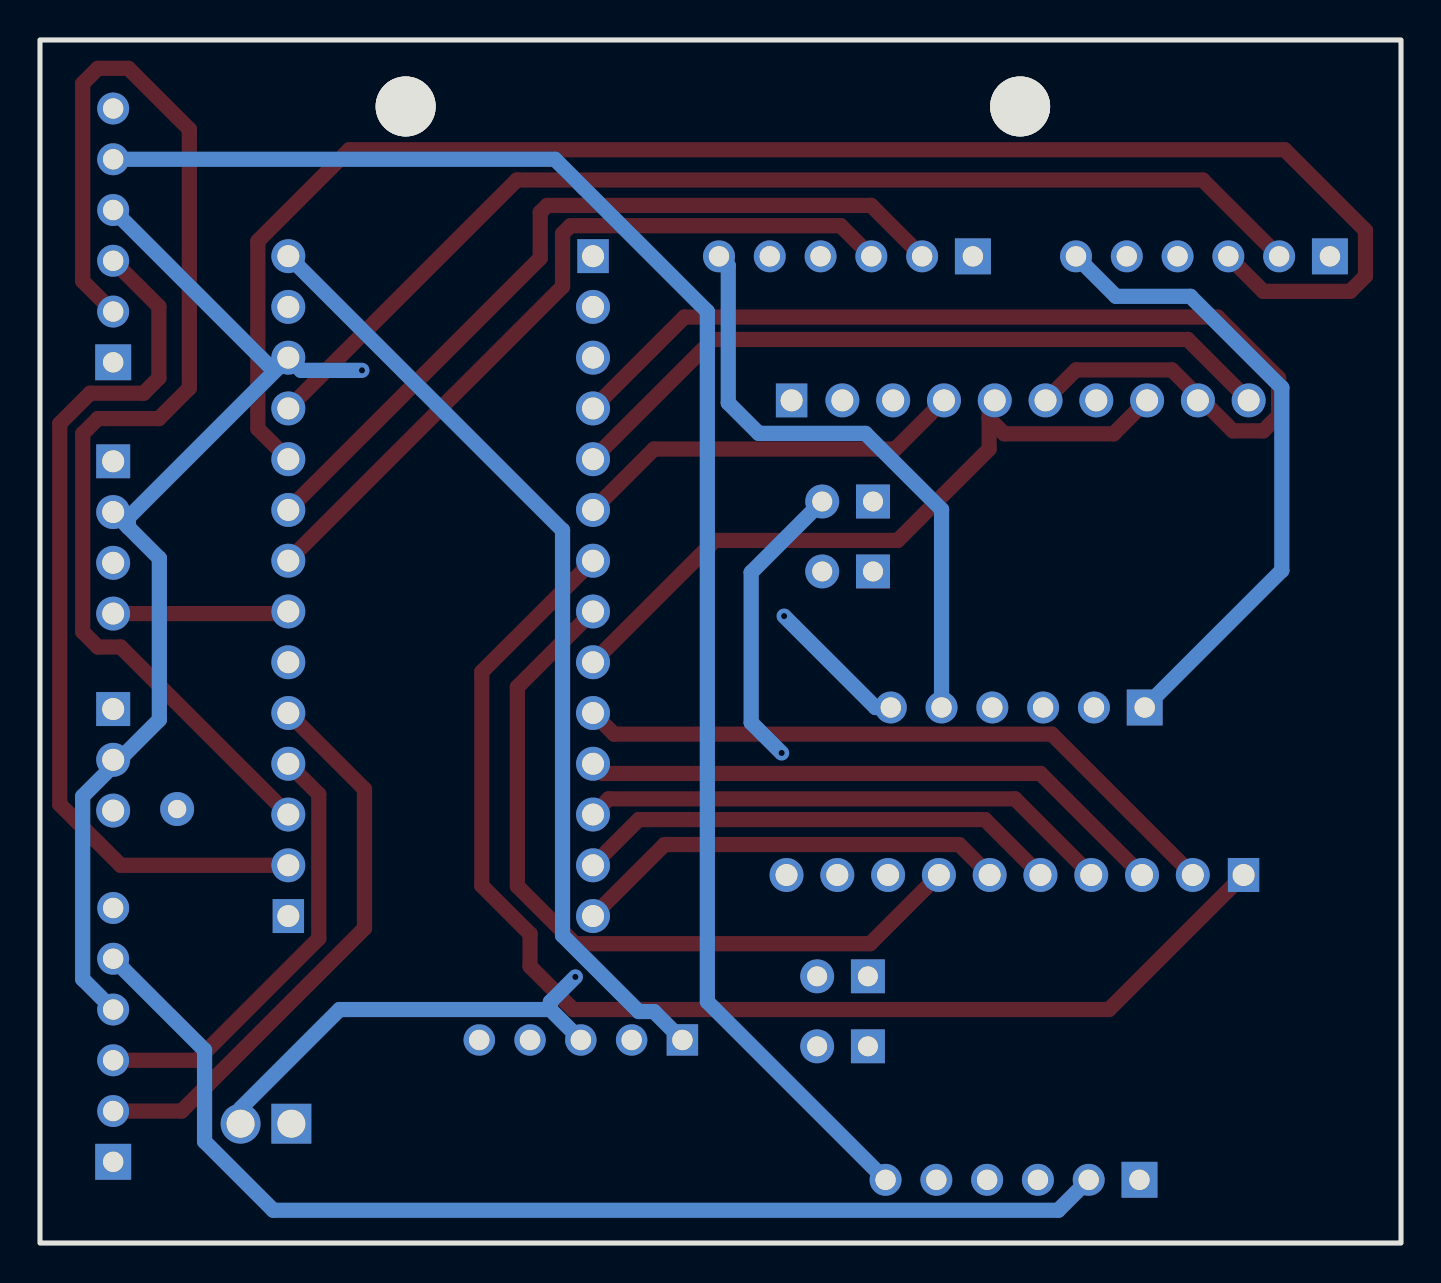
[diagram p10: board, bottom side, seen from below]

Outline 68.07 x 60.2 mm; copper layers: Top Layer, Inner1, Inner2, Bottom Layer. Coordinates in mm from the lower left corner of the outline.
Outline path: rectangle 0,60.2 68.07,0
Stack: Top Layer 0.035mm Outer layer thickness 1oz / Dielectric1 0.2104mm 7628 RC49% 8.6mil / Inner1 0.0152mm Inner layer thickness / Dielectric2 1.065mm 1.1mm H/HOZ Copper / Inner2 0.0152mm Inner layer thickness / Dielectric3 0.2104mm 7628 RC49% 8.6mil / Bottom Layer 0.035mm Outer layer thickness 1oz

## Design rules (mm)
template: Custom Config
spacing copperThickness1oz (default): track to track 0.254, other pairs 0.152 to 0.3
spacing copperThickness2oz: track to track 0.203, other pairs 0.152 to 0.3
track width copperThickness1oz (default): min 0.127, default 0.762, max 2.54
track width copperThickness2oz: min 0.203, default 0.254, max 2.54
differential pair differentialPair (default): width min 0.127, default 0.254, max 2.54; gap min 0.152, default 0.152
via viaSize (default): diameter min 0.5, default 0.61, max 10; hole min 0.3, default 0.305, max 6.3

## Placement (name value [footprint] x y rotation side)
H10  -  [HDR-TH_3P-P2.54-V-M]  64.41 24.18 270 top
H13  -  [HDR-TH_10P-P2.54-V-F]  19.05 42.16 180 top
H14  -  [HDR-TH_10P-P2.54-V-F]  19.3 18.42 0 top
H15  -  [HDR-TH_6P-P2.54-V-F]  19.17 26.8 0 top
H16  -  [HDR-TH_6P-P2.54-V-F]  19.43 3.16 0 top
H17  2.54-1*14P母  [HDR-TH_14P-P2.54-V-F-1]  55.65 32.87 90 top
H18  2.54-1*14P母  [HDR-TH_14P-P2.54-V-F-1]  40.41 32.87 270 top
H22  -  [HDR-TH_6P-P2.54-V-F]  9.91 49.37 0 top
H23  -  [HDR-TH_6P-P2.54-V-F]  27.76 49.37 0 top
H24  -  [HDR-TH_6P-P2.54-V-F]  64.41 10.41 90 top
H25  -  [HDR-TH_6P-P2.54-V-F]  64.41 50.42 90 top
H26  -  [HDR-TH_4P-P2.54-V-F]  64.41 35.31 270 top
H27  -  [HDR-TH_2P-P2.54-V-F]  27.68 33.6 0 top
H28  -  [HDR-TH_2P-P2.54-V-F]  27.68 37.1 0 top
H29  -  [HDR-TH_2P-P2.54-V-F]  27.93 9.84 0 top
H30  -  [HDR-TH_2P-P2.54-V-F]  27.93 13.35 0 top
H31  -  [HDR-TH_5P-P2.54-V-F]  41.02 10.16 0 top
NOREF  -  [Pad_e30454]  19.05 56.87 0 top
NOREF#2  -  [Pad_e10617]  61.21 21.72 0 top
NOREF#3  -  [Pad_e30453]  49.78 56.87 0 top
U8  XY308-2.54-2P  [CONN-TH_XY308-2.54-2P]  56.77 5.97 0 top

## Footprints (pads in the part's own frame, mm; a bottom-side part is the same pattern mirrored in y, then rotated)
CONN-TH_XY308-2.54-2P
  rect 2x2 hole 1.4: 1(-1.27,0)
  round 2 hole 1.4: 2(1.27,0)
HDR-TH_2P-P2.54-V-F
  rect 1.7x1.7 hole 1: 1(-1.27,0)
  round 1.7 hole 1: 2(1.27,0)
HDR-TH_3P-P2.54-V-M
  rect 1.7x1.7 hole 1.1: 1(-2.54,0)
  round 1.7 hole 1.1: 2(0,0) 3(2.54,0)
HDR-TH_4P-P2.54-V-F
  rect 1.7x1.7 hole 1.1: 1(-3.81,0)
  round 1.7 hole 1.1: 2(-1.27,0) 3(1.27,0) 4(3.81,0)
HDR-TH_5P-P2.54-V-F
  rect 1.575x1.575 hole 1.02: 1(-5.08,0)
  round 1.575 hole 1.02: 2(-2.54,0) 3(0,0) 4(2.54,0) 5(5.08,0)
HDR-TH_6P-P2.54-V-F
  rect 1.8x1.8 hole 1.02: 1(-6.35,0)
  round 1.6 hole 1.02: 2(-3.81,0) 3(-1.27,0) 4(1.27,0) 5(3.81,0) 6(6.35,0)
HDR-TH_10P-P2.54-V-F
  rect 1.575x1.7 hole 1.1: 1(-11.43,0)
  round 1.7 hole 1.1: 2(-8.89,0) 3(-6.35,0) 4(-3.81,0) 5(-1.27,0) 6(1.27,0) 7(3.81,0) 8(6.35,0) 9(8.89,0) 10(11.43,0)
HDR-TH_14P-P2.54-V-F-1
  rect 1.7x1.575 hole 1.1: 1(-16.51,0)
  round 1.7 hole 1.1: 2(-13.97,0) 3(-11.43,0) 4(-8.89,0) 5(-6.35,0) 6(-3.81,0) 7(-1.27,0) 8(1.27,0) 9(3.81,0) 10(6.35,0) 11(8.89,0) 12(11.43,0) 13(13.97,0) 14(16.51,0)
Pad_e10617
  round 1.7 hole 0.914: 1(0,0)
Pad_e30453
  round 3 hole 3: 1(0,0)
Pad_e30454
  round 3 hole 3: 2(0,0)

## Nets
3.3V: H10.2 H13.2 H14.9 H17.12 H22.4 H23.4 H24.4 H25.4 H26.2
5V: H17.14 H31.1
7.6V: H28.2 H30.2 H31.3 U8.2
GND: H10.1 H18.1 H22.1 H23.1 H24.1 H25.1 H26.1 H27.1 H29.1 H31.2 U8.1
ENC1: H17.11 H22.2
ENC2: H17.10 H22.3
ENC3: H17.9 H23.2
ENC4: H17.8 H23.3
ENC5: H17.5 H24.2
ENC6: H17.4 H24.3
ENC7: H17.3 H25.2
ENC8: H17.2 H25.3
MOT1: H15.1 H22.6
MOT2: H15.2 H22.5
MOT3: H15.5 H23.6
MOT4: H15.6 H23.5
MOT5: H16.1 H24.6
MOT6: H16.2 H24.5
MOT7: H16.5 H25.6
MOT8: H16.6 H25.5
PWM1: H13.10 H18.5
PWM2: H13.4 H18.6
PWM3: H14.1 H18.7
PWM4: H14.7 H18.8
SCL: H17.7 H26.4
SDA: H17.6 H26.3
$1N1434: H14.6 H18.14
$1N1438: H14.5 H18.13
$1N1442: H14.4 H18.12
$1N1446: H14.3 H18.11
$1N1450: H14.2 H18.10
$1N1454: H13.6 H13.9 H18.4
$1N1462: H13.5 H13.8 H18.9

Pads without a net: H10 3; H13 1 3 7; H14 8 10; H15 3 4; H16 3 4; H17 1 13; H18 2 3; H27 2; H28 1; H29 2; H30 1; H31 4 5; NOREF 2; NOREF#2 1; NOREF#3 1

## Via types
v1: diameter 0.61, hole 0.305, Top Layer to Bottom Layer, 4 vias

## Routing (per net, layer and track width the routed paths; a pad name or vN(x,y) marks a point on that pad's centre or on a via; arc(x,y) is an arc through that point)
3.3V: length 135.3
  Inner2 w0.762: H14.9 28.19,30.48 30.48,32.77 30.48,39.62 H13.2 28.27,42.49 28.27,47.85 ; v1(51.97,43.67) 51.97,43.67 44.74,50.9 30.56,50.9 H23.4 28.27,48.61 28.27,47.85 ; 28.27,47.85 27.51,47.09 20.65,47.09 16.84,50.9 12.7,50.9 H22.4
  Bottom Layer w0.762: H25.4 56.65,43.92 56.03,43.92 ; 63.65,35.81 H26.2 ; 63.65,35.81 62.1,34.27 62.1,26.19 64.41,23.88 ; 63.65,35.81 63.65,36.3 56.03,43.92 ; 56.03,43.92 H17.12 55.02,43.67 v1(51.97,43.67) ; H24.4 65.94,13.21 65.94,22.35 64.41,23.88 ; 64.41,23.88 H10.2
5V: length 47.8
  Bottom Layer w0.762: H31.1 37.36,11.58 38.13,11.58 41.94,15.39 41.94,35.67 H17.14
7.6V: length 61.8
  Inner2 w0.762: v1(41.3,13.32) 31.01,13.32 30.98,13.35 ; 30.98,13.35 H30.2 ; 30.98,13.35 32.5,14.87 32.5,23 v1(30.98,24.52)
  Bottom Layer w0.762: v1(41.3,13.32) 42.55,12.07 42.55,11.68 ; H28.2 32.5,33.55 32.5,26.05 v1(30.98,24.52) ; 42.55,11.68 53.09,11.68 58.04,6.73 U8.2 ; 42.55,11.68 H31.3
GND: length 168.1
  Inner1 w0.762: H25.1 H26.1 65.94,37.59 65.94,28.24 H10.1 62.89,25.2 62.89,4.83 ; 30.86,8.64 30.1,7.87 28.63,7.87 H29.1 ; 30.86,8.64 32.39,10.16 32.39,27.63 H27.1 27.93,35.13 29.46,35.13 32.5,38.18 32.5,42.75 ; 30.86,8.64 36.96,8.64 38.48,10.16 42.67,5.97 U8.1 57.41,4.06 59.08,4.06 59.84,4.83 62.89,4.83 ; H18.1 33.78,42.75 32.5,42.75 ; 32.5,42.75 27.93,47.32 23.46,47.32 H23.1 19.89,47.85 5.08,47.85 H22.1 ; 62.89,4.83 63.65,4.83 H24.1
ENC1: length 55.9
  Top Layer w0.762: H17.11 44.22,53.19 9.92,53.19 H22.2
ENC2: length 80.7
  Top Layer w0.762: H17.10 57.18,40.75 57.18,50.13 52.6,54.71 5.82,54.71 1.78,50.67 1.78,48.38 2.54,47.62 6.88,47.62 H22.3
ENC3: length 40.4
  Top Layer w0.762: H23.2 26.5,51.92 42.7,51.92 43.05,51.57 43.05,49.28 H17.9
ENC4: length 38.3
  Top Layer w0.762: H23.3 28.03,50.91 41.53,50.91 41.94,50.5 41.94,47.86 H17.8
ENC5: length 28.7
  Top Layer w0.762: H24.2 60.99,6.6 51.84,15.75 51.84,22.71 H17.5
ENC6: length 22.2
  Top Layer w0.762: 64.41,9.14 60.22,9.14 54.13,15.24 54.13,22.46 H17.4
ENC7: length 62.2
  Top Layer w0.762: H25.2 65.94,48.13 65.94,58.02 65.17,58.78 63.65,58.78 60.6,55.73 60.6,42.78 62.13,41.25 65.17,41.25 65.94,40.49 65.94,30.59 65.17,29.82 64.03,29.82 H17.3
ENC8: length 44.5
  Top Layer w0.762: H25.3 62.13,46.86 62.13,43.29 62.89,42.52 65.56,42.52 67.08,41 67.08,21.95 64.03,18.9 H17.2
MOT1: length 31.9
  Bottom Layer w0.762: H15.1 5.96,33.66 5.96,42.8 10.53,47.37 14.26,47.37 H22.6
MOT2: length 30.3
  Inner2 w0.762: H15.2 15.36,32.13 6.1,41.39 6.1,42.92 10.67,47.49 11.84,47.49 H22.5
MOT3: length 30.3
  Bottom Layer w0.762: H23.6 33.65,48.91 33.65,42.04 32.12,40.51 26.79,40.51 22.98,36.7 H15.5
MOT4: length 26.2
  Inner2 w0.762: H23.5 32.38,48.57 32.38,32.89 v1(30.85,31.37)
  Bottom Layer w0.762: v1(30.85,31.37) 26.28,26.8 H15.6
MOT5: length 58.2
  Inner2 w0.762: H24.6 55.27,7.62 32.41,7.62 26.43,1.64 14.61,1.64 H16.1
MOT6: length 57.3
  Bottom Layer w0.762: 64.41,14.22 59.84,9.65 59.84,5.08 56.4,1.64 17.15,1.64 H16.2
MOT7: length 78.6
  Inner2 w0.762: H25.6 60.6,56.77 53.74,49.91 53.74,24 41.55,11.81 34.69,11.81 27.84,4.95 25.03,4.95 H16.5
MOT8: length 80
  Bottom Layer w0.762: H25.5 42.31,54.23 34.69,46.61 34.69,12.08 H16.6
PWM1: length 36.5
  Top Layer w0.762: H13.10 10.67,45.21 34.42,45.21 H18.5
PWM2: length 19.8
  Top Layer w0.762: H18.6 37.36,39.73 25.3,39.73 H13.4
PWM3: length 63
  Top Layer w0.762: H18.7 45.97,28.58 45.97,17.88 43.56,15.47 43.56,13.84 41.4,11.68 14.61,11.68 H14.1
PWM4: length 39
  Top Layer w0.762: H14.7 26.55,14.98 41.31,14.98 44.2,17.86 44.2,27.82 H18.8
SCL: length 8.8
  Top Layer w0.762: H26.4 55.76,31.5 H17.7
SDA: length 10.8
  Inner1 w0.762: H26.3 60.63,34.04 H17.6
$1N1434: length 22
  Top Layer w0.762: H14.6 22.1,19.94 36.83,19.94 H18.14
$1N1438: length 24.5
  Top Layer w0.762: H14.5 20.81,21.19 38.13,21.19 H18.13
$1N1442: length 26.8
  Top Layer w0.762: H18.12 39.63,22.23 19.3,22.23 H14.4
$1N1446: length 29.8
  Top Layer w0.762: H18.11 39.93,23.5 18.03,23.5 H14.3
$1N1450: length 33.4
  Top Layer w0.762: H14.2 17.46,25.46 39.36,25.46 H18.10
$1N1454: length 53.4
  Top Layer w0.762: 9.93,42.16 8.41,40.64 6.88,40.64 6.12,41.4 6.12,43.29 9.17,46.33 35.84,46.33 H18.4 ; 9.93,42.16 H13.9 ; 9.93,42.16 11.46,43.69 16.26,43.69 H13.6
$1N1462: length 35.7
  Top Layer w0.762: H13.8 14.37,40.49 19.84,40.49 20.6,41.25 ; 20.6,41.25 20.6,39.73 25.17,35.16 34.32,35.16 H18.9 ; 20.6,41.25 20.6,41.88 H13.5

## Text on the board
Top Silkscreen Layer: Vakhtang Inasaridze | MRV2
